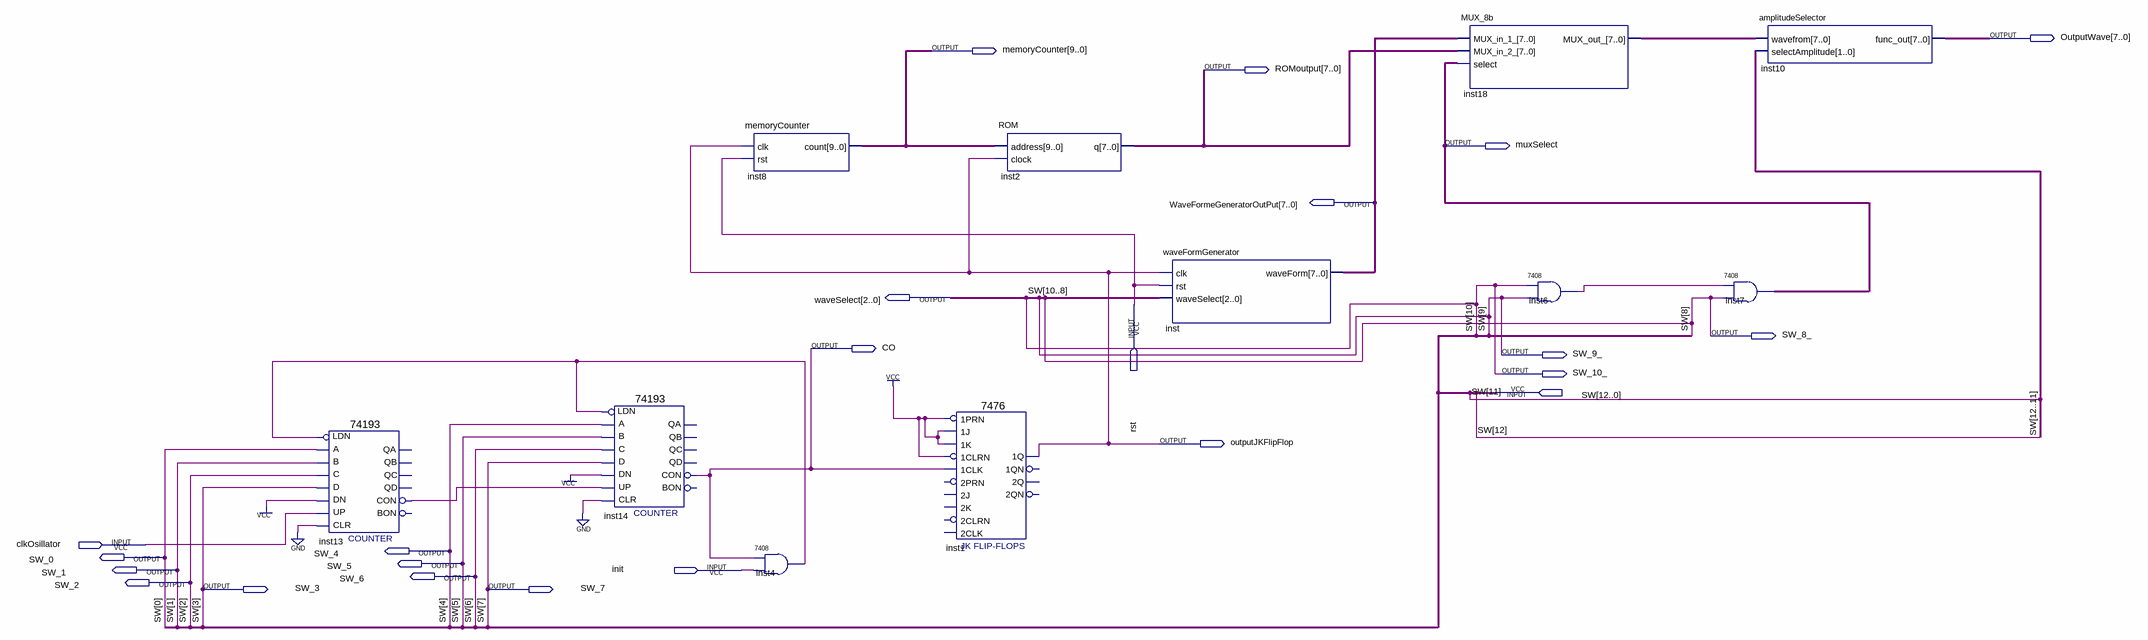
[diagram p0: schematic sheet]
// Quartus schematic waveForm_Generator.bdf as structural Verilog: 11 symbols, 23 pins
module waveForm_Generator (
  input  rst,
  input  [12:0] SW,
  input  clkOsillator,
  input  init,
  output [7:0] OutputWave,
  output [9:0] memoryCounter,
  output [7:0] ROMoutput,
  output muxSelect,
  output [7:0] WaveFormeGeneratorOutPut,
  output [2:0] waveSelect,
  output SW_8_,
  output CO,
  output SW_9_,
  output SW_10_,
  output outputJKFlipFlop,
  output SW_4,
  output SW_0,
  output SW_5,
  output SW_1,
  output SW_6,
  output SW_2,
  output SW_3,
  output SW_7
);

  wire inst4_1, inst6_1, inst13_con;
  wire [7:0] inst18_mux_out_;

  \74193  inst13 (
    .D(SW[3]), .C(SW[2]), .B(SW[1]), .A(SW[0]), .CLR(1'b0), .UP(clkOsillator), .DN(1'b1), .LDN(inst4_1),
    .CON(inst13_con));  // open: QB, QA, QD, QC, BON
  \74193  inst14 (
    .D(SW[7]), .C(SW[6]), .B(SW[5]), .A(SW[4]), .CLR(1'b0), .UP(inst13_con), .DN(1'b1), .LDN(inst4_1),
    .CON(CO));  // open: QB, QA, QD, QC, BON
  memoryCounter inst8 (.clk(outputJKFlipFlop), .rst(rst), .count(memoryCounter));
  \7408  inst4 (.\3 (init), .\2 (CO), .\1 (inst4_1));
  \7476  inst1 (
    .\1J (1'b1), .\1K (1'b1), .\1PRN (1'b1), .\1CLK (CO), .\1CLRN (1'b1), .\1Q (outputJKFlipFlop));  // open: 2PRN, 2J, 2K, 2CLRN, 2CLK, 2QN, 2Q, 1QN
  ROM inst2 (.address(memoryCounter), .clock(outputJKFlipFlop), .q(ROMoutput));
  waveFormGenerator inst (
    .clk(outputJKFlipFlop), .rst(rst), .waveSelect(SW[10:8]), .waveForm(WaveFormeGeneratorOutPut));
  MUX_8b inst18 (
    .MUX_in_1_(WaveFormeGeneratorOutPut), .MUX_in_2_(ROMoutput), .select(muxSelect),
    .MUX_out_(inst18_mux_out_));
  \7408  inst6 (.\3 (SW[9]), .\2 (SW[10]), .\1 (inst6_1));
  \7408  inst7 (.\3 (SW[8]), .\2 (inst6_1), .\1 (muxSelect));
  amplitudeSelector inst10 (.wavefrom(inst18_mux_out_), .selectAmplitude(SW[12:11]), .func_out(OutputWave));

  assign SW_0 = SW[0];
  assign SW_1 = SW[1];
  assign SW_2 = SW[2];
  assign SW_3 = SW[3];
  assign SW_4 = SW[4];
  assign SW_5 = SW[5];
  assign SW_6 = SW[6];
  assign SW_7 = SW[7];
  assign SW_8_ = SW[8];
  assign SW_9_ = SW[9];
  assign SW_10_ = SW[10];
  assign waveSelect = SW[10:8];
endmodule
